# EAGLE design TimesDetector (EAGLE 8.7.0)

## Sheet 1 of 2
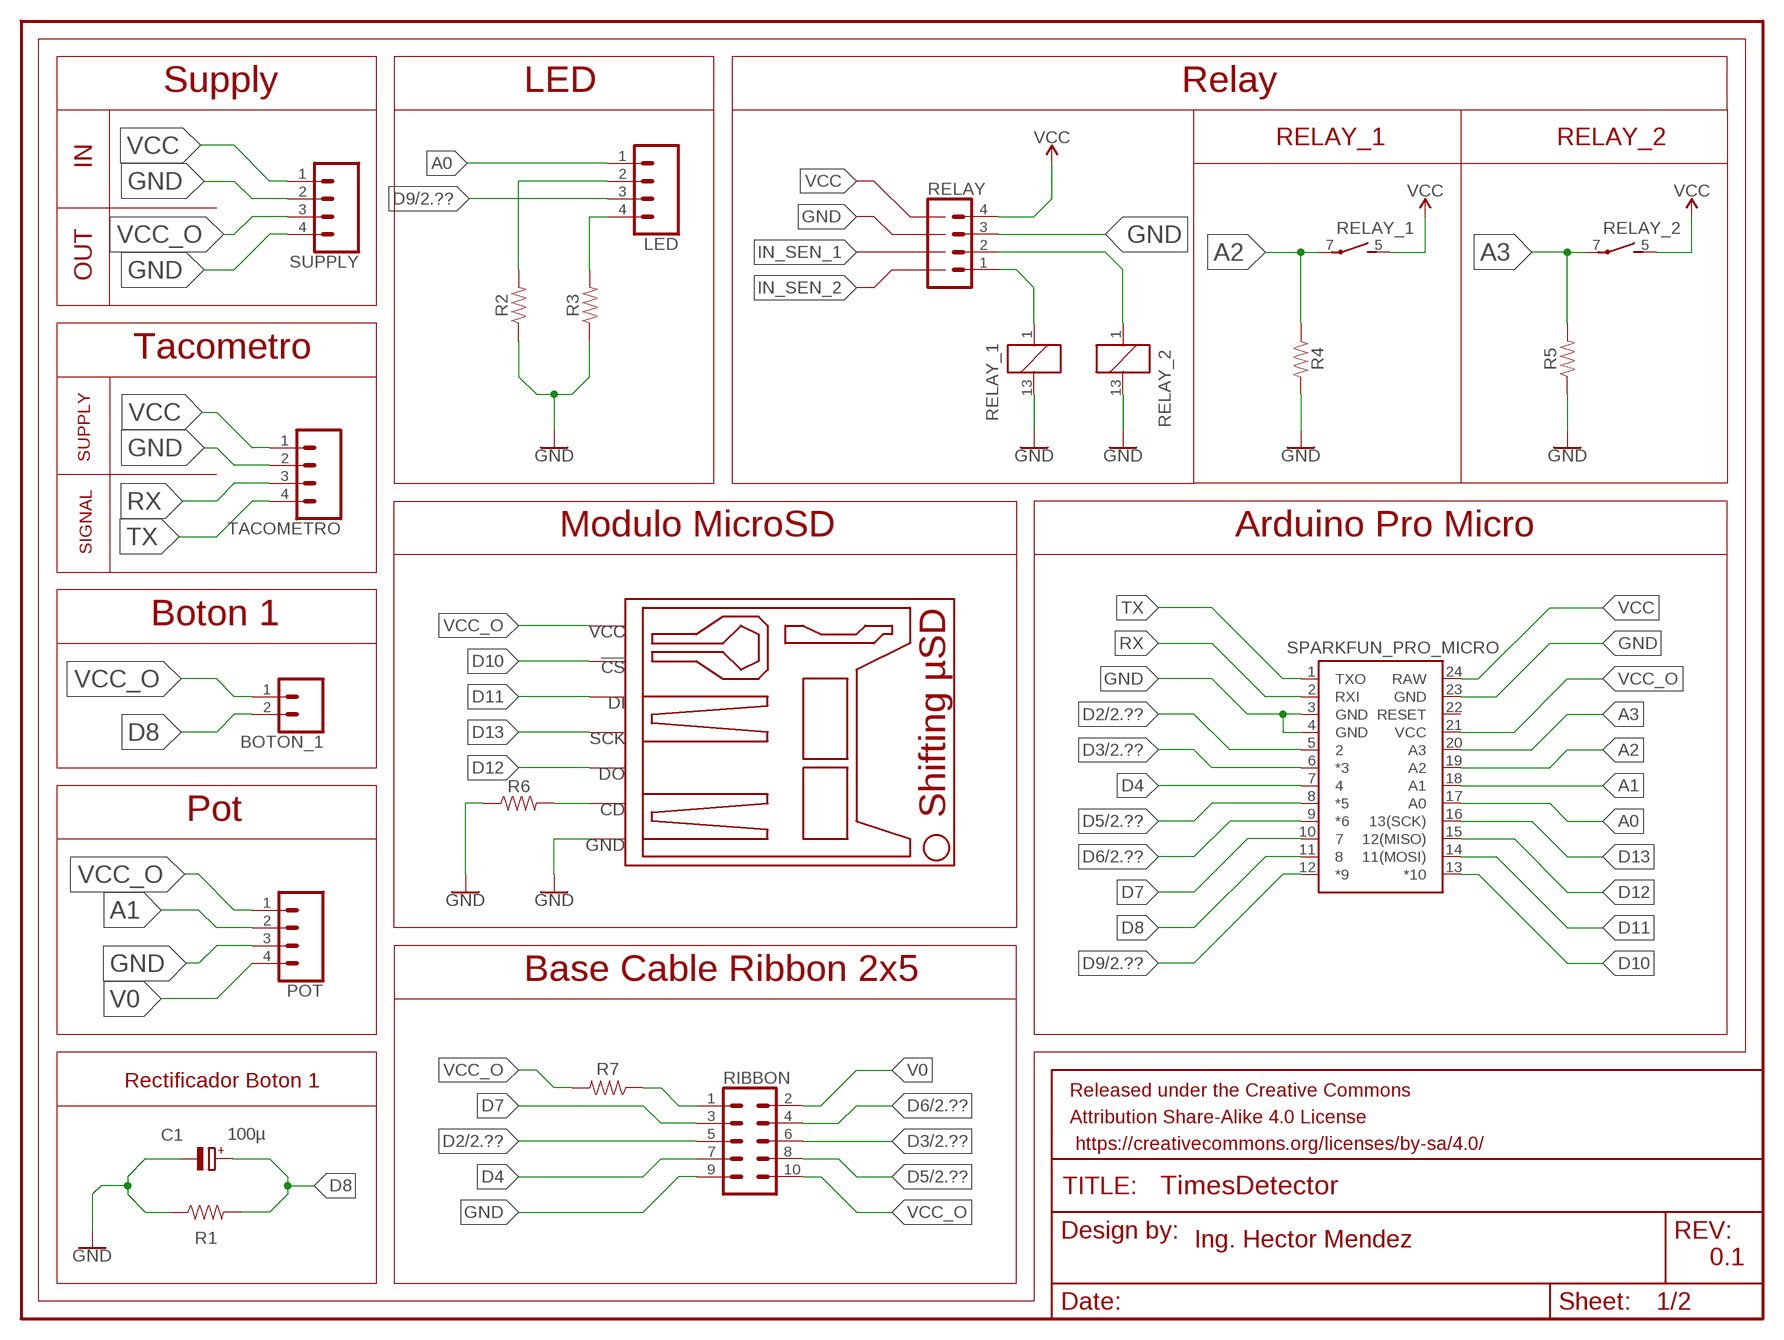
[diagram p0: schematic, sheet 1]

### Parts
B1  SPARKFUN_PRO_MICRO  [SPARKFUN_PRO_MICRO]
BOTON_1  CONN_025MM  [SCREWTERMINAL-5MM-2]
C1  100µ  CPOL-EUE2,5-6E  [E2,5-6E]
FRAME1  FRAME-LETTER  [CREATIVE_COMMONS]
LED  CONN_04SCREW_LOCK  [SCREWTERMINAL-3.5MM-4_LOCK]
MODULE1  MICROSD_SPARKFUN_LEVEL_SHIFTING_MODULE  [MICROSD_SPARKFUN_LEVEL_SHFTING_MODULE]
POT  CONN_04SCREW_LOCK  [SCREWTERMINAL-3.5MM-4_LOCK]
R1  RESISTORAXIAL-0.3  [AXIAL-0.3]
R2  RESISTORAXIAL-0.3  [AXIAL-0.3]
R3  RESISTORAXIAL-0.3  [AXIAL-0.3]
R4  RESISTORAXIAL-0.3  [AXIAL-0.3]
R5  RESISTORAXIAL-0.3  [AXIAL-0.3]
R6  RESISTORAXIAL-0.3  [AXIAL-0.3]
R7  RESISTORAXIAL-0.3  [AXIAL-0.3]
RELAY  CONN_04SCREW_LOCK  [SCREWTERMINAL-3.5MM-4_LOCK]
RELAY_1  G6D-1A-ASI12VDC  [G6D]
RELAY_2  G6D-1A-ASI12VDC  [G6D]
RIBBON  CONN_05X2SHD  [2X5-SHROUDED]
SUPPLY  CONN_04SCREW_LOCK  [SCREWTERMINAL-3.5MM-4_LOCK]
TACOMETRO  CONN_04SCREW_LOCK  [SCREWTERMINAL-3.5MM-4_LOCK]

### Nets
A0: B1.17(A0) LED.1
A1: B1.18(A1) POT.2
A2: B1.19(A2) R4.P$1 RELAY_1.7(2:P)
A3: B1.20(A3) R5.P$2 RELAY_2.7(2:P)
D2: B1.5 RIBBON.5 ; also sheet 2
D3: B1.6(*3) RIBBON.6 ; also sheet 2
D4: B1.7 RIBBON.7
D5: B1.8(*5) RIBBON.8 ; also sheet 2
D6: B1.9(*6) RIBBON.4 ; also sheet 2
D7: B1.10 RIBBON.3
D8: B1.11 BOTON_1.2 C1.+ R1.P$2
D9: B1.12(*9) LED.3 ; also sheet 2
D10: B1.13(*10) MODULE1.P_!CS
D11: B1.14(11(MOSI)) MODULE1.P_DI
D12: B1.15(12(MISO)) MODULE1.P_DO
D13: B1.16(13(SCK)) MODULE1.P_SCK
GND: B1.3(GND) B1.4(GND) B1.23(GND) C1.- MODULE1.P_GND(GND) POT.3 R1.P$1 R2.P$1 R3.P$1 R4.P$2 R5.P$1 R6.P$1 RELAY.3 RELAY_1.13 RELAY_2.13 RIBBON.9 SUPPLY.2 SUPPLY.4 TACOMETRO.2
IN_SEN_1: RELAY.2 RELAY_2.1
IN_SEN_2: RELAY.1 RELAY_1.1
N$1: MODULE1.P_CD R6.P$2
N$2: LED.4 R3.P$2
N$4: LED.2 R2.P$2
N$8: R7.P$1 RIBBON.1
RX: B1.2(RXI) TACOMETRO.3
TX: B1.1(TXO) TACOMETRO.4
V0: POT.4 RIBBON.2
VCC: B1.24(RAW) RELAY.4 RELAY_1.5(2:S) RELAY_2.5(2:S) SUPPLY.1 TACOMETRO.1
VCC_O: B1.21(VCC) BOTON_1.1 MODULE1.P_VCC POT.1 R7.P$2 RIBBON.10 SUPPLY.3
Unconnected: B1.22(RESET)

### Notes on the sheet
- Supply | LED | Relay
- RELAY_1 | RELAY_2
- IN
- OUT
- Tacometro
- SUPPLY
- Modulo MicroSD | Arduino Pro Micro
- SIGNAL
- Boton 1
- Pot
- Base Cable Ribbon 2x5
- Rectificador Boton 1
- Ing. Hector Mendez
- 0.1

## Sheet 2 of 2
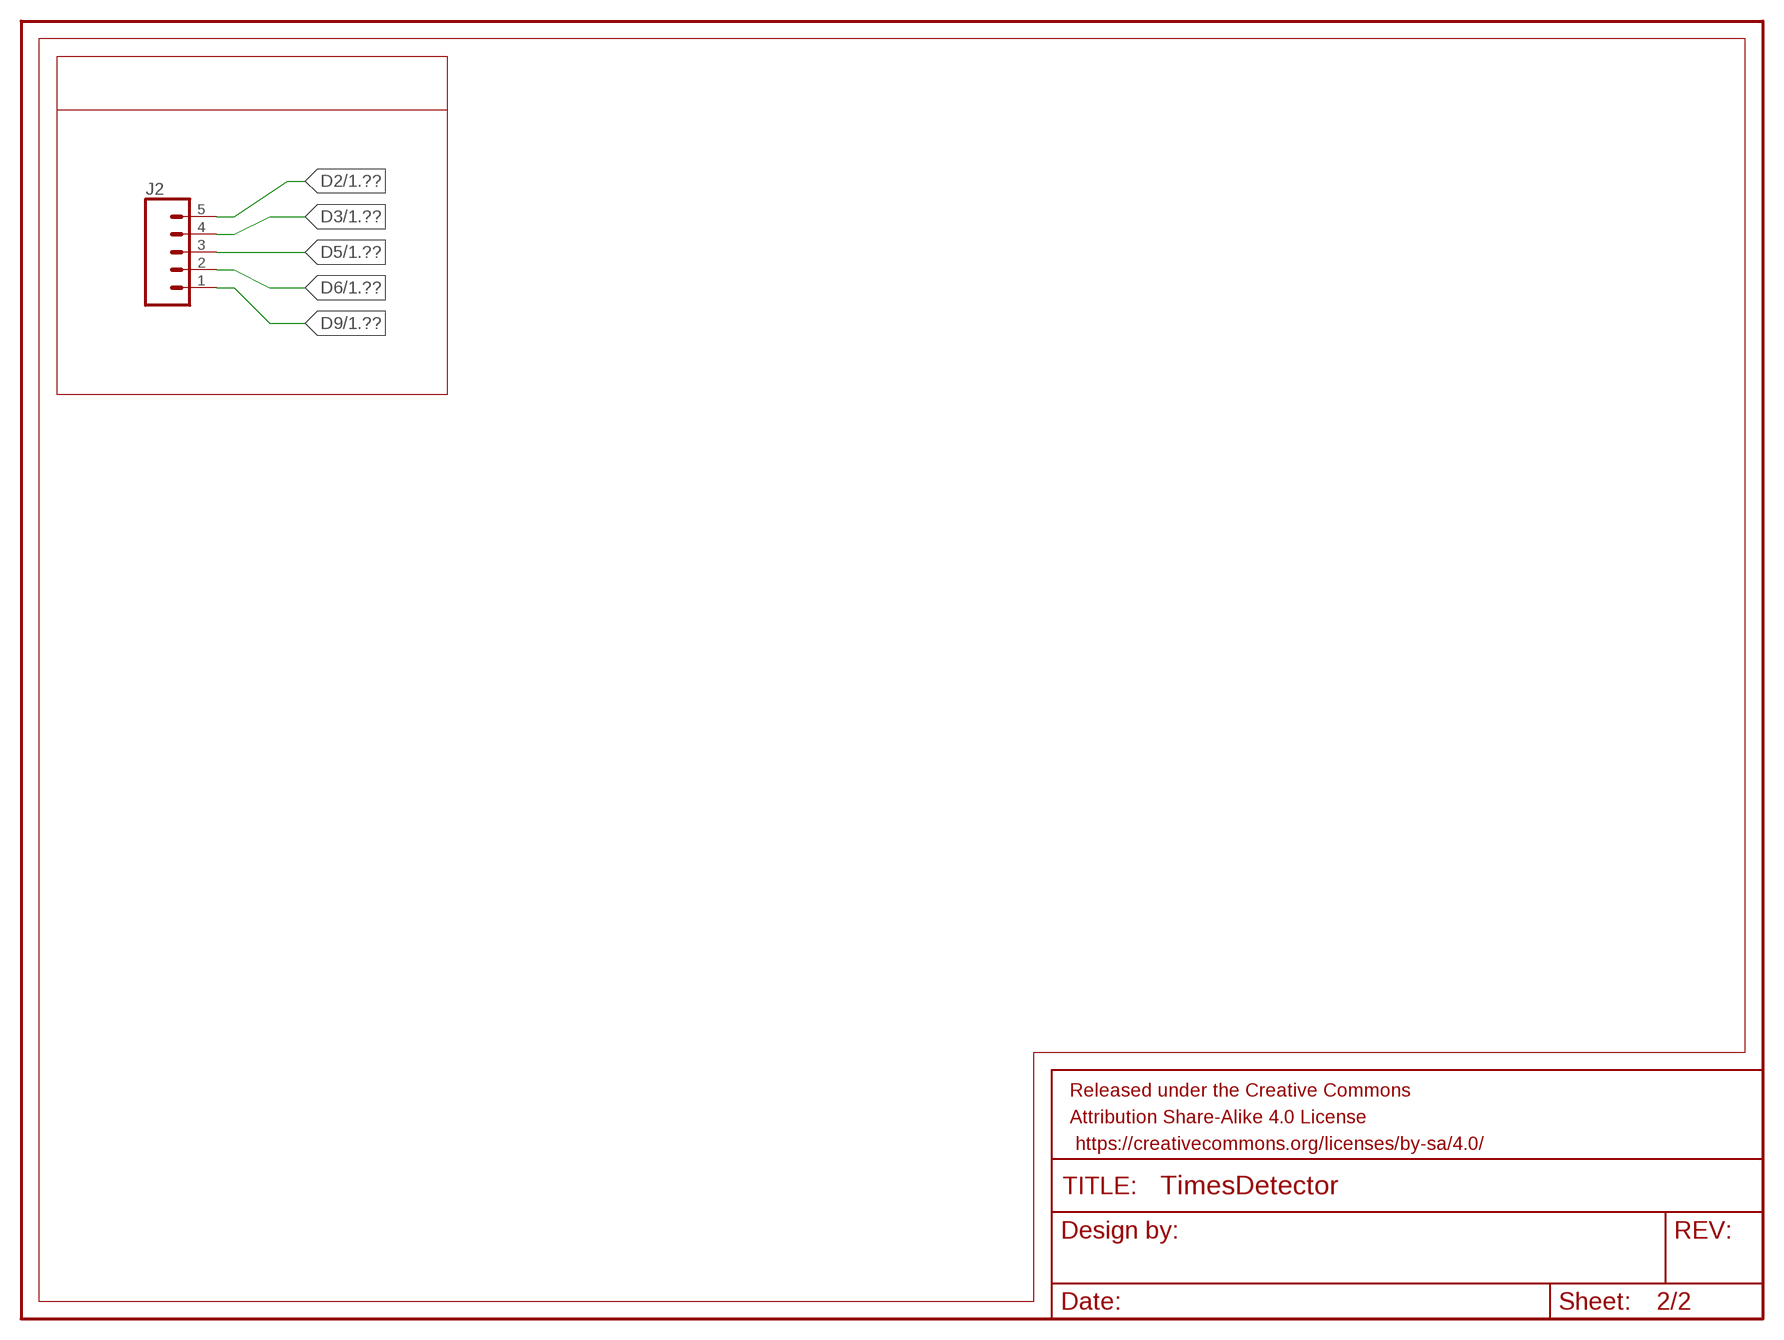
[diagram p1: schematic, sheet 2]

### Parts
FRAME3  FRAME-LETTERNO_PACKAGE  [DUMMY]
J2  CONN_05PTH_LONGPADS  [1X05_LONGPADS]

### Nets
D2: J2.5 ; also sheet 1
D3: J2.4 ; also sheet 1
D5: J2.3 ; also sheet 1
D6: J2.2 ; also sheet 1
D9: J2.1 ; also sheet 1

## Library data of the parts
B1 = SparkFun-Boards:SPARKFUN_PRO_MICRO: SparkFun Pro Micro Atmega32U4 compatible footprint. SparkFun Products: 3.3V/8MHz <https://www.sparkfun.com/products/12587> 5V/16MHz <https://www.sparkfun.com/products/12640>
BOTON_1 = SparkFun-Connectors:CONN_02: Multi connection point. Often used as Generic Header-pin footprint for 0.1 inch spaced/style header connections On any of the 0.1 inch spaced packages, you can populate with these: Break Away Headers - Straight <https://www.sparkfun.com/products/116> (PRT-00116) Break Away Male Headers - Right Angle <https://www.sparkfun.com/products/553> (PRT-00553) Female Headers <https://www.sparkfun.com/products/115> (PRT-00115) Break Away Headers - Machine Pin <https://www.sparkfun.com/products/117> (PRT-00117) Break Away Female Headers - Swiss Machine Pin <https://www.sparkfun.com/products/743> (PRT-00743) For SCREWTERMINALS and SPRING TERMINALS visit here: Screw Terimnals on SparkFun.com <https://www.sparkfun.com/search/results?term=Screw+Terminals> (5mm/3.5mm/2.54mm spacing) This device is also useful as a general connection point to wire up your design to another part of your project. Our various solder wires solder well into these plated through hole pads. Hook-Up Wire - Assortment (Stranded, 22 AWG) <https://www.sparkfun.com/products/11375> (PRT-11375) Hook-Up Wire - Assortment (Solid Core, 22 AWG) <https://www.sparkfun.com/products/11367> (PRT-11367) View the entire wire category on our website here <https://www.sparkfun.com/categories/141> Special notes: Molex polarized connector foot print use with: PRT-08233 with associated crimp pins and housings. 2.54_SCREWTERM for use with PRT-10571. 3.5mm Screw Terminal footprints for PRT-08084 5mm Screw Terminal footprints for use with PRT-08432; SF_SKU: PRT-08432
C1 = resistor:CPOL-EU: POLARIZED CAPACITOR, European symbol
FRAME1 = SparkFun-Aesthetics:FRAME-LETTER: Schematic Frame - Letter Standard 8.5x11 US Letter frame
FRAME3 = SparkFun-Aesthetics:FRAME-LETTER: Schematic Frame - Letter Standard 8.5x11 US Letter frame; DESIGNER: Nobody; VERSION: v01
J2 = SparkFun-Connectors:CONN_05: Multi connection point. Often used as Generic Header-pin footprint for 0.1 inch spaced/style header connections On any of the 0.1 inch spaced packages, you can populate with these: Break Away Headers - Straight <https://www.sparkfun.com/products/116> (PRT-00116) Break Away Male Headers - Right Angle <https://www.sparkfun.com/products/553> (PRT-00553) Female Headers <https://www.sparkfun.com/products/115> (PRT-00115) Break Away Headers - Machine Pin <https://www.sparkfun.com/products/117> (PRT-00117) Break Away Female Headers - Swiss Machine Pin <https://www.sparkfun.com/products/743> (PRT-00743) For SCREWTERMINALS and SPRING TERMINALS visit here: Screw Terimnals on SparkFun.com <https://www.sparkfun.com/search/results?term=Screw+Terminals> (5mm/3.5mm/2.54mm spacing) This device is also useful as a general connection point to wire up your design to another part of your project. Our various solder wires solder well into these plated through hole pads. Hook-Up Wire - Assortment (Stranded, 22 AWG) <https://www.sparkfun.com/products/11375> (PRT-11375) Hook-Up Wire - Assortment (Solid Core, 22 AWG) <https://www.sparkfun.com/products/11367> (PRT-11367) View the entire wire category on our website here <https://www.sparkfun.com/categories/141> Special notes: Molex polarized connector foot print use with SKU : PRT-08231 with associated crimp pins and housings. 1MM SMD Version SKU: PRT-10208
LED POT RELAY SUPPLY TACOMETRO = SparkFun-Connectors:CONN_04: Multi connection point. Often used as Generic Header-pin footprint for 0.1 inch spaced/style header connections On any of the 0.1 inch spaced packages, you can populate with these: Break Away Headers - Straight <https://www.sparkfun.com/products/116> (PRT-00116) Break Away Male Headers - Right Angle <https://www.sparkfun.com/products/553> (PRT-00553) Female Headers <https://www.sparkfun.com/products/115> (PRT-00115) Break Away Headers - Machine Pin <https://www.sparkfun.com/products/117> (PRT-00117) Break Away Female Headers - Swiss Machine Pin <https://www.sparkfun.com/products/743> (PRT-00743) For SCREWTERMINALS and SPRING TERMINALS visit here: Screw Terimnals on SparkFun.com <https://www.sparkfun.com/search/results?term=Screw+Terminals> (5mm/3.5mm/2.54mm spacing) This device is also useful as a general connection point to wire up your design to another part of your project. Our various solder wires solder well into these plated through hole pads. Hook-Up Wire - Assortment (Stranded, 22 AWG) <https://www.sparkfun.com/products/11375> (PRT-11375) Hook-Up Wire - Assortment (Solid Core, 22 AWG) <https://www.sparkfun.com/products/11367> (PRT-11367) View the entire wire category on our website here <https://www.sparkfun.com/categories/141> Special notes: Molex polarized connector foot print use with SKU : PRT-08231 with associated crimp pins and housings. 1MM SMD Version SKU: PRT-10208
MODULE1 = MODULOS_MICROSD:MICROSD_SPARKFUN_LEVEL_SHIFTING_MODULE
R1-R7 = SparkFun-Resistors:RESISTOR: Generic Resistor Package
RELAY_1 RELAY_2 = relay:G6D?*: OMRON Slim, Miniature PCB Relay 17.5 × 6.5 × 12.5 mm with Socked Source: http://ecb.omron.com.sg/pdf/relay/power/G6D.pdf; OC_FARNELL: unknown; OC_NEWARK: unknown
RIBBON = SparkFun-Connectors:CONN_05X2: Multi connection point. Often used as Generic Header-pin footprint for 0.1 inch spaced/style header connections For AVR SPI programming port, see special device with nice symbol: "AVR_SPI_PROG_5x2.dev" You can populate with any combo of single row headers, but if you'd like an exact match, check these: 2x5 AVR ICSP Male Header <https://www.sparkfun.com/products/778> (PRT-00778) 2x5 Pin Shrouded Header <https://www.sparkfun.com/products/8506> (PRT-08506) On any of the 0.1 inch spaced packages, you can populate with these: Break Away Headers - Straight <https://www.sparkfun.com/products/116> (PRT-00116) Break Away Male Headers - Right Angle <https://www.sparkfun.com/products/553> (PRT-00553) Female Headers <https://www.sparkfun.com/products/115> (PRT-00115) Break Away Headers - Machine Pin <https://www.sparkfun.com/products/117> (PRT-00117) Break Away Female Headers - Swiss Machine Pin <https://www.sparkfun.com/products/743> (PRT-00743) Special note: the shrouded connector mates well with our 5x2 ribbon cables: 2x5 Pin IDC Ribbon Cable <https://www.sparkfun.com/products/8535> (PRT-08535); PROD_ID: CONN-08671; SF_ID: PRT-08506

## Board
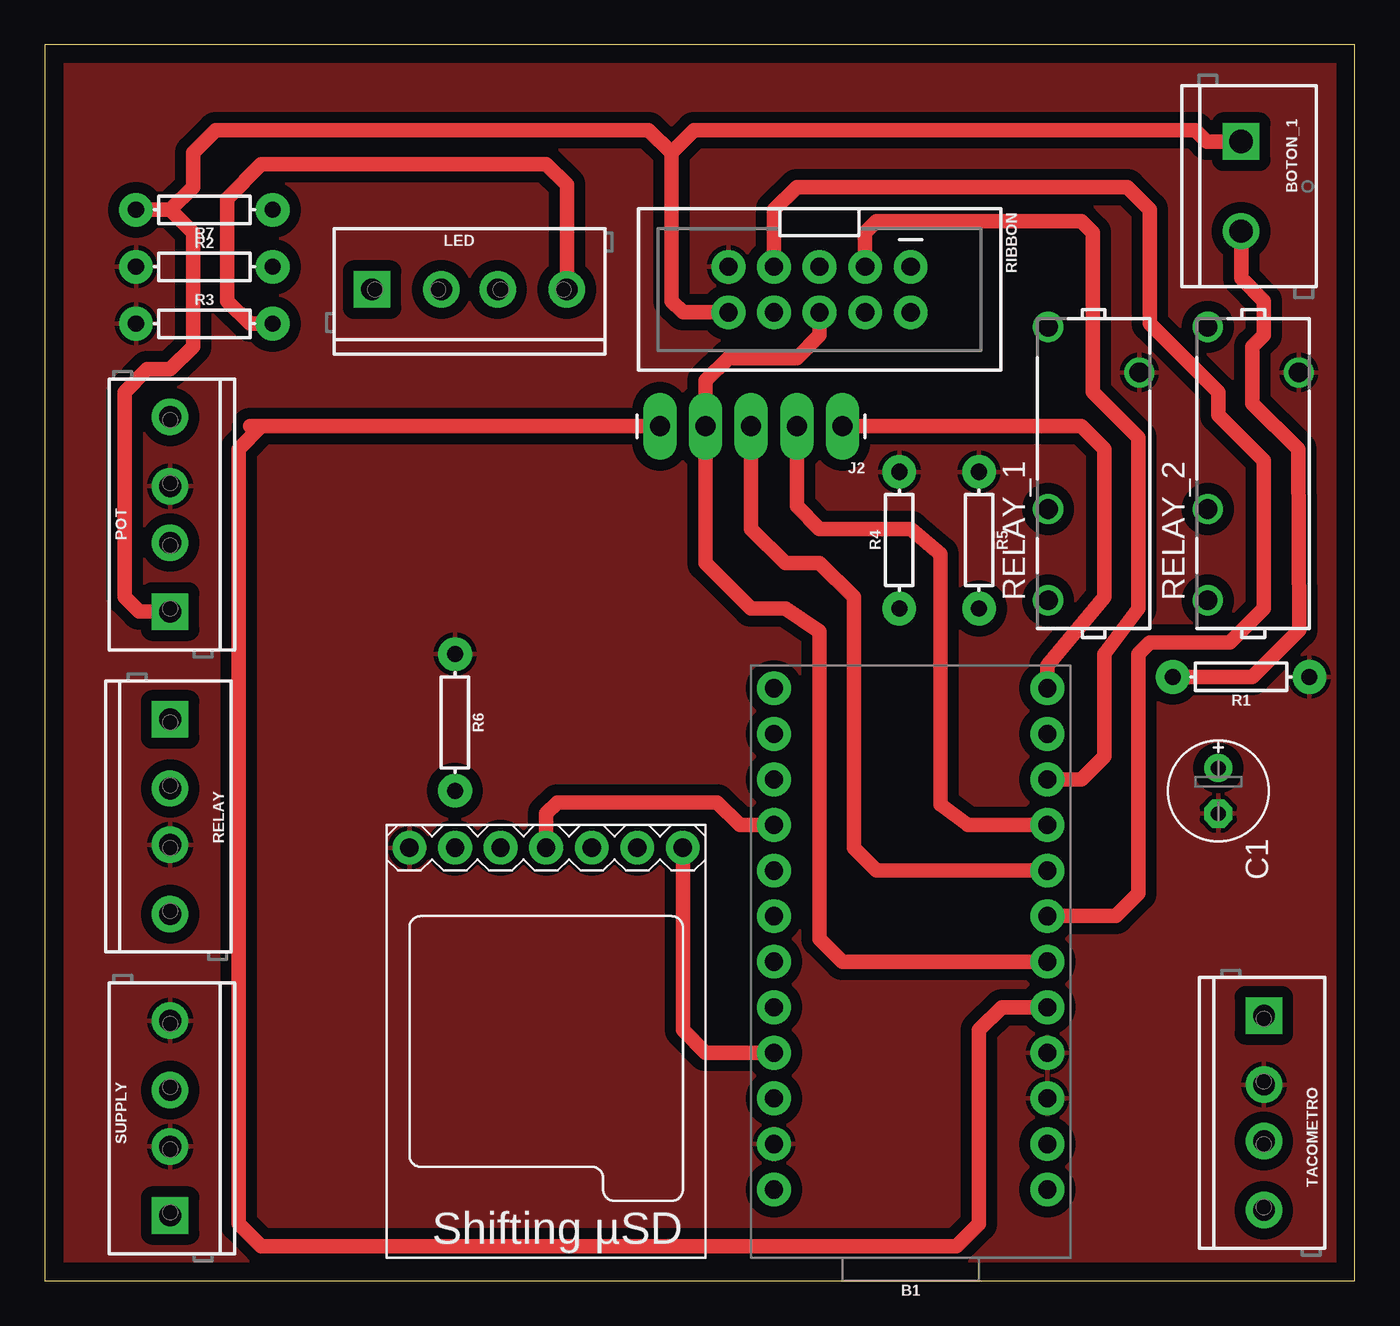
[diagram p2: board, top side]
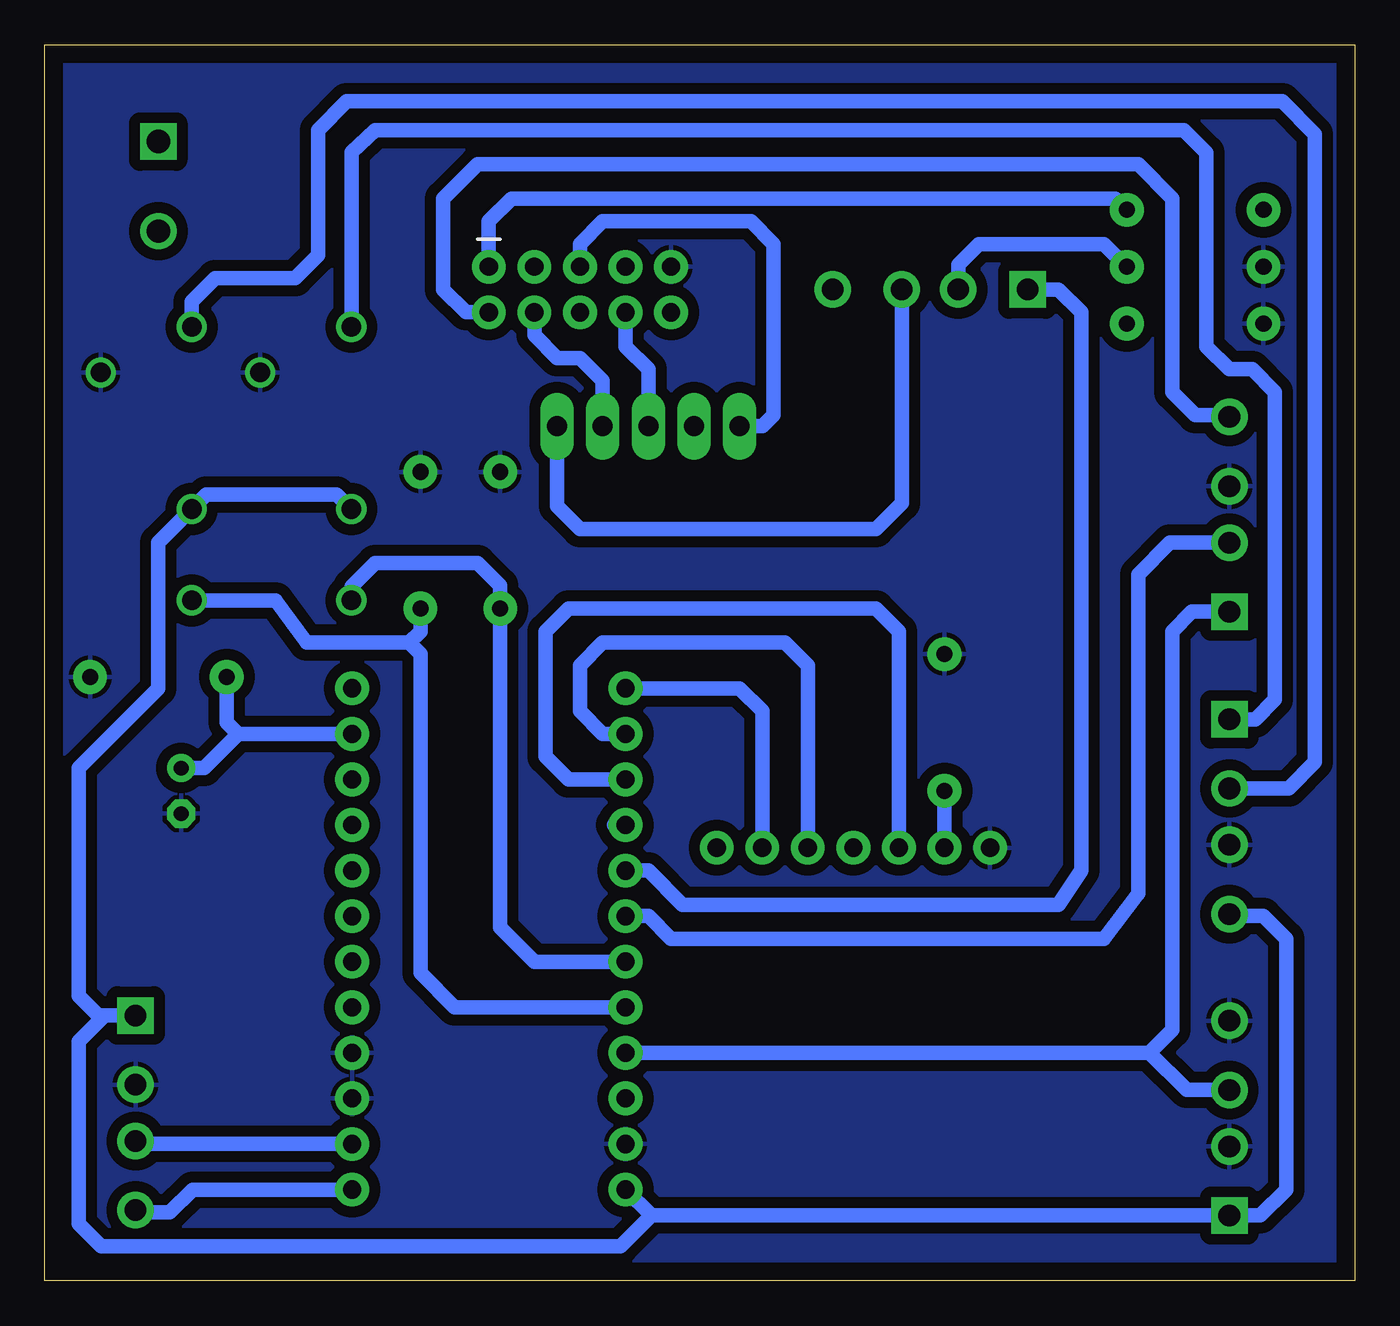
[diagram p3: board, bottom side, seen from below]

Size 73.01 x 68.89 mm. Coordinates in mm from the lower left corner, seen from the top.
Outline: 0,0 73.01,0 73.01,68.89 0,68.89 0,0
Copper layers (1*16): Top 0.035mm / dielectric 1.5mm / Bottom 0.035mm
Design rules "default": minimum track width 6mil, minimum drill 0.35mm, track to track 6mil, track to pad 6mil, pad to pad 6mil, via to via 6mil, smd to smd 6mil, copper to edge 40mil, drill to drill 6mil, minimum pad ring 10mil, minimum via ring 8mil, stop-mask expansion 4mil, vias tented up to drill 0mil, thermal gap 10mil

### Footprints (pad centres in the part's own frame; a part is rotated, then mirrored left to right if it is on the bottom)
SPARKFUN_PRO_MICRO = drill 1.016 pad 1.88: 1 -7.62,12.7; 2 -7.62,10.16; 3 -7.62,7.62; 4 -7.62,5.08; 5 -7.62,2.54; 6 -7.62,0; 7 -7.62,-2.54; 8 -7.62,-5.08; 9 -7.62,-7.62; 10 -7.62,-10.16; 11 -7.62,-12.7; 12 -7.62,-15.24; 13 7.62,-15.24; 14 7.62,-12.7; 15 7.62,-10.16; 16 7.62,-7.62; 17 7.62,-5.08; 18 7.62,-2.54; 19 7.62,0; 20 7.62,2.54; 21 7.62,5.08; 22 7.62,7.62; 23 7.62,10.16; 24 7.62,12.7
SCREWTERMINAL-5MM-2 = drill 1.3 pad 2.032 square: 1 0,0 | drill 1.3 pad 2.032: 2 5,0
E2,5-6E = drill 0.813 pad 1.575: + -1.27,0 | drill 0.813 pad 1.575 octagon: - 1.27,0
1X05_LONGPADS = drill 1.118 pad 1.88 long: 1 0,0; 2 2.54,0; 3 5.08,0; 4 7.62,0; 5 10.16,0
SCREWTERMINAL-3.5MM-4_LOCK = drill 1.2 pad 2.032 square: 1 -0.178,0 | drill 1.2 pad 2.032: 2 3.678,0; 3 6.822,0; 4 10.678,0
MICROSD_SPARKFUN_LEVEL_SHFTING_MODULE = drill 1.016 pad 1.88: P_!CS 3.81,1.27; P_CD 13.97,1.27; P_DI 6.35,1.27; P_DO 11.43,1.27; P_GND 16.51,1.27; P_SCK 8.89,1.27; P_VCC 1.27,1.27
AXIAL-0.3 = drill 0.9 pad 1.88: P$1 -3.81,0; P$2 3.81,0
G6D = drill 1.1 pad 1.676: 1 8.08,2.5; 5 -2.08,2.5; 7 -7.16,2.5; 13 5.54,-2.58
2X5-SHROUDED = drill 1.016 pad 1.88: 1 -1.27,5.08; 2 1.27,5.08; 3 -1.27,2.54; 4 1.27,2.54; 5 -1.27,0; 6 1.27,0; 7 -1.27,-2.54; 8 1.27,-2.54; 9 -1.27,-5.08; 10 1.27,-5.08

### Placement (x,y rotation side)
B1  48.26,17.78 180 top
BOTON_1  66.68,63.5 270 top
C1  65.41,27.3 270 top
FRAME1  15.24,-10.79 0 top  (outside the outline)
FRAME3  -5.08,-12.06 0 top  (outside the outline)
J2  44.45,47.62 180 top
LED  18.42,55.24 0 top
MODULE1  36.83,25.4 180 top
POT  6.98,37.47 90 top
R1  66.68,33.66 180 top
R2  8.89,56.52 0 top
R3  8.89,53.34 0 top
R4  47.62,41.27 90 top
R5  52.07,41.27 270 top
R6  22.86,31.11 270 top
R7  8.89,59.69 180 top
RELAY  6.98,31.11 270 top
RELAY_1  58.42,45.09 90 top
RELAY_2  67.31,45.09 90 top
RIBBON  43.18,55.24 270 top
SUPPLY  6.98,3.81 90 top
TACOMETRO  67.95,14.61 270 top

### Tracks (layer width: path | path; a pad name or v marks a point on that pad's centre or on a via)
A0
  Bottom 0.813: B1.17 39.37,22.86 37.46,20.95 16.51,20.95 15.24,22.86 15.24,53.98 16.51,55.24 LED.1
A1
  Bottom 0.813: POT.2 10.29,41.14 12.06,39.37 12.06,21.59 13.97,19.05 38.1,19.05 39.37,20.32 B1.18
A2
  Bottom 0.813: B1.19 45.72,17.78 47.62,19.68 R4.P$1 47.62,38.73 48.89,40.01 54.61,40.01 55.92,38.7 RELAY_1.7
A3
  Bottom 0.813: B1.20 50.16,15.24 52.07,17.14 52.07,34.92 52.7,35.56 | RELAY_2.7 60.15,37.92 58.42,35.56 52.7,35.56 | R5.P$2 52.07,36.2 52.7,35.56
D2
  Top 0.813: J2.5 12.06,47.62 | 12.06,47.62 11.43,47.62 | 12.06,47.62 10.79,46.35 10.79,3.17 12.06,1.91 50.8,1.91 52.07,3.17 52.07,13.97 53.34,15.24 B1.5
  Bottom 0.813: RIBBON.5 43.18,57.78 41.91,59.05 33.66,59.05 32.38,57.78 32.38,48.26 33.02,47.62 J2.5
D3
  Top 0.813: RIBBON.6 43.18,52.7 41.91,51.44 38.1,51.44 36.83,50.16 J2.4 36.83,40.01 39.37,37.47 41.27,37.47 43.18,36.2 43.18,19.05 44.45,17.78 B1.6
D4
  Top 0.813: B1.7 59.69,20.32 60.96,21.59 60.96,34.92 61.59,35.56 66.04,35.56 67.95,37.47 67.95,45.72 65.41,48.26 65.41,49.53 61.59,53.34 61.59,59.69 60.32,60.96 41.91,60.96 40.64,59.69 RIBBON.7
D5
  Top 0.813: J2.3 39.37,41.91 41.27,40.01 43.18,40.01 45.09,38.1 45.09,24.13 46.35,22.86 B1.8
  Bottom 0.813: J2.3 39.37,50.8 40.64,52.07 RIBBON.8
D6
  Top 0.813: J2.2 41.91,43.18 43.18,41.91 48.26,41.91 49.91,40.51 49.91,26.54 51.43,25.4 B1.9
  Bottom 0.813: RIBBON.4 45.72,52.7 44.45,51.44 43.18,51.44 41.91,50.16 J2.2
D7
  Top 0.813: B1.10 57.78,27.94 59.05,29.21 59.05,34.92 60.96,37.47 60.96,46.99 58.42,49.53 58.42,58.42 57.78,59.05 46.35,59.05 45.72,58.42 RIBBON.3
D8
  Top 0.813: BOTON_1.2 66.68,55.88 67.95,54.61 67.95,52.7 67.31,52.07 67.31,48.9 69.85,46.35 69.93,36.27 67.31,33.66 R1.P$2
  Bottom 0.813: 62.23,30.48 62.86,31.11 R1.P$2 | 62.23,30.48 B1.11 | C1.+ 64.14,28.57 62.23,30.48
D9
  Top 0.813: J2.1 57.78,47.62 59.05,46.35 59.05,38.1 55.88,34.29 B1.12
  Bottom 0.813: LED.3 25.24,43.34 26.67,41.91 43.18,41.91 44.45,43.18 J2.1
D10
  Bottom 0.813: B1.13 34.29,33.02 33.02,31.75 MODULE1.P_!CS
D11
  Bottom 0.813: MODULE1.P_DI 30.48,34.29 31.75,35.56 41.91,35.56 43.18,34.29 43.18,31.75 41.91,30.48 B1.14
D12
  Bottom 0.813: MODULE1.P_DO 25.4,36.2 26.67,37.47 43.81,37.47 45.09,36.2 45.09,29.21 43.81,27.94 B1.15
D13
  Top 0.813: MODULE1.P_SCK 27.94,26.04 28.58,26.67 37.46,26.67 38.73,25.4 B1.16
  Bottom 0.813: B1.16 41.27,25.4
GND
  pour Bottom (isolate 0.61): 0.64,68.58 0.64,0 73.03,0 73.03,68.58
  pour Top (isolate 0.61): 0.64,69.22 0.64,0.64 73.03,0 73.03,68.58
IN_SEN_1
  Bottom 0.813: RELAY.2 3.68,27.44 2.21,28.91 2.21,63.9 4.04,65.73 56.18,65.73 57.78,64.14 57.78,57.15 59.05,55.88 63.5,55.88 64.81,54.57 RELAY_2.1
IN_SEN_2
  Bottom 0.813: RELAY.1 5.54,31.29 4.45,32.38 4.45,49.53 5.71,50.8 6.98,50.8 8.26,52.07 8.26,62.87 9.53,64.14 54.61,64.14 55.92,62.91 RELAY_1.1
N$1
  Bottom 0.813: MODULE1.P_CD R6.P$2
N$2
  Top 0.813: R3.P$2 11.43,53.34 10.16,54.61 10.16,60.33 12.06,62.23 27.94,62.23 29.09,61.08 LED.4
N$4
  Bottom 0.813: R2.P$2 13.97,57.78 20.96,57.78 22.09,56.65 LED.2
N$8
  Bottom 0.813: RIBBON.1 48.26,59.05 46.99,60.33 13.33,60.33 R7.P$1
RX
  Bottom 0.813: B1.2 67.78,7.62 TACOMETRO.3
TX
  Bottom 0.813: B1.1 64.77,5.08 66.04,3.81 67.83,3.81 TACOMETRO.4
V0
  Bottom 0.813: POT.4 6.87,48.14 6.98,48.26 8.89,48.26 10.16,49.53 10.16,60.33 12.06,62.23 48.89,62.23 50.8,60.33 50.8,55.24 49.53,53.98 RIBBON.2
VCC
  Bottom 0.813: RELAY.4 6.87,20.32 5.08,20.32 3.81,19.05 3.81,5.08 5.26,3.63 SUPPLY.1 39.19,3.63 | RELAY_1.5 56.73,43.81 64,43.81 RELAY_2.5 66.68,41.14 66.68,33.02 71.12,28.57 71.12,15.88 70.03,14.78 69.67,14.78 | B1.24 39.19,3.63 | 39.19,3.63 40.92,1.91 69.85,1.91 71.12,3.17 71.12,13.34 69.67,14.78 | TACOMETRO.1 69.67,14.78
VCC_O
  Top 0.813: R7.P$2 6.98,59.69 | 6.98,59.69 8.26,58.42 8.26,52.07 6.98,50.8 5.71,50.8 4.45,49.53 4.45,38.1 5.26,37.29 POT.1 | MODULE1.P_VCC 35.56,13.97 36.83,12.7 B1.21 | BOTON_1.1 64.77,63.5 64.14,64.14 36.2,64.14 34.92,62.87 | RIBBON.10 35.56,53.98 34.92,54.61 34.92,62.87 | 34.92,62.87 33.66,64.14 9.53,64.14 8.26,62.87 8.26,60.96 6.98,59.69
  Bottom 0.813: POT.1 9.07,37.29 10.16,36.2 10.16,13.97 11.43,12.7 | SUPPLY.3 9.36,10.63 11.43,12.7 | 11.43,12.7 B1.21